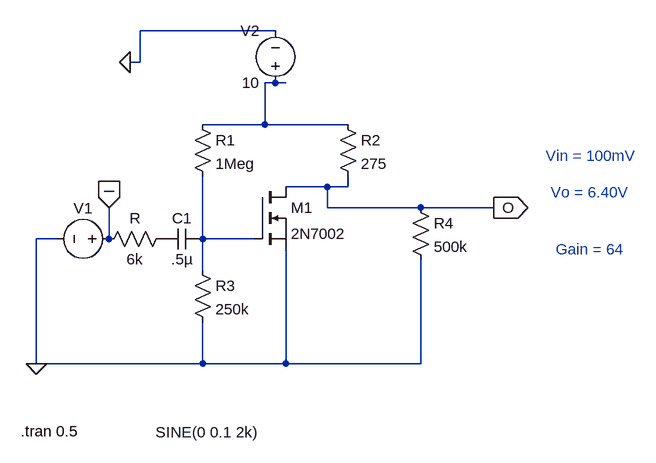
[diagram p0: schematic NNM24EE064 Likith.asc]
NNM24EE064 Likith.asc, the LTspice schematic file:
Version 4
SHEET 1 1032 680
WIRE 464 -208 256 -208
WIRE 256 -160 256 -208
WIRE 256 -160 240 -160
WIRE 464 -128 448 -128
WIRE 480 -128 464 -128
WIRE 448 -64 448 -128
WIRE 448 -64 352 -64
WIRE 576 -64 448 -64
WIRE 544 32 480 32
WIRE 576 32 576 16
WIRE 576 32 544 32
WIRE 544 64 544 32
WIRE 688 64 544 64
WIRE 800 64 688 64
WIRE 128 112 96 112
WIRE 208 112 208 64
WIRE 352 112 352 16
WIRE 432 112 352 112
WIRE 352 160 352 112
WIRE 96 304 96 112
WIRE 352 304 352 240
WIRE 352 304 96 304
WIRE 480 304 480 128
WIRE 480 304 352 304
WIRE 688 304 688 144
WIRE 688 304 480 304
FLAG 208 64 I
IOPIN 208 64 In
FLAG 800 64 O
IOPIN 800 64 Out
FLAG 96 304 0
FLAG 240 -160 0
SYMBOL voltage 224 112 R90
WINDOW 0 -32 56 VBottom 2
WINDOW 3 282 -135 VTop 2
WINDOW 123 0 0 Left 0
WINDOW 39 0 0 Left 0
SYMATTR InstName V1
SYMATTR Value SINE(0 0.1 2k)
SYMBOL voltage 464 -112 R180
WINDOW 0 24 96 Left 2
WINDOW 3 24 16 Left 2
SYMATTR InstName V2
SYMATTR Value 10
SYMBOL res 336 -80 R0
SYMATTR InstName R1
SYMATTR Value 1Meg
SYMBOL res 560 -80 R0
SYMATTR InstName R2
SYMATTR Value 275
SYMBOL res 336 144 R0
SYMATTR InstName R3
SYMATTR Value 250k
SYMBOL res 672 48 R0
SYMATTR InstName R4
SYMATTR Value 500k
SYMBOL nmos 432 32 R0
SYMATTR InstName M1
SYMATTR Value 2N7002
SYMBOL res 304 96 R90
WINDOW 0 0 56 VBottom 2
WINDOW 3 32 56 VTop 2
SYMATTR InstName R
SYMATTR Value 6k
SYMBOL cap 352 96 R90
WINDOW 0 0 32 VBottom 2
WINDOW 3 32 32 VTop 2
SYMATTR InstName C1
SYMATTR Value .5µ
TEXT 72 408 Left 2 !.tran 0.5
TEXT 888 40 Left 2 ;Vo = 6.40V
TEXT 880 -16 Left 2 ;Vin = 100mV
TEXT 896 128 Left 2 ;Gain = 64

The netlist it stands for:
* NNM24EE064 Likith.asc
V1 I 0 SINE(0 0.1 2k)
V2 N001 0 10
R1 N001 N002 1Meg
R2 N001 O 275
R3 N002 0 250k
R4 O 0 500k
M1 O N002 0 0 2N7002
R P001 I 6k
C1 N002 P001 .5µ
.model NMOS NMOS
.model PMOS PMOS
.lib standard.mos
.tran 0.5
* Vo = 6.40V
* Vin = 100mV
* Gain = 64
.backanno
.end